# EAGLE design Interface_ETH (EAGLE 9.6.2)

## Sheet 1 of 3: Ethernet
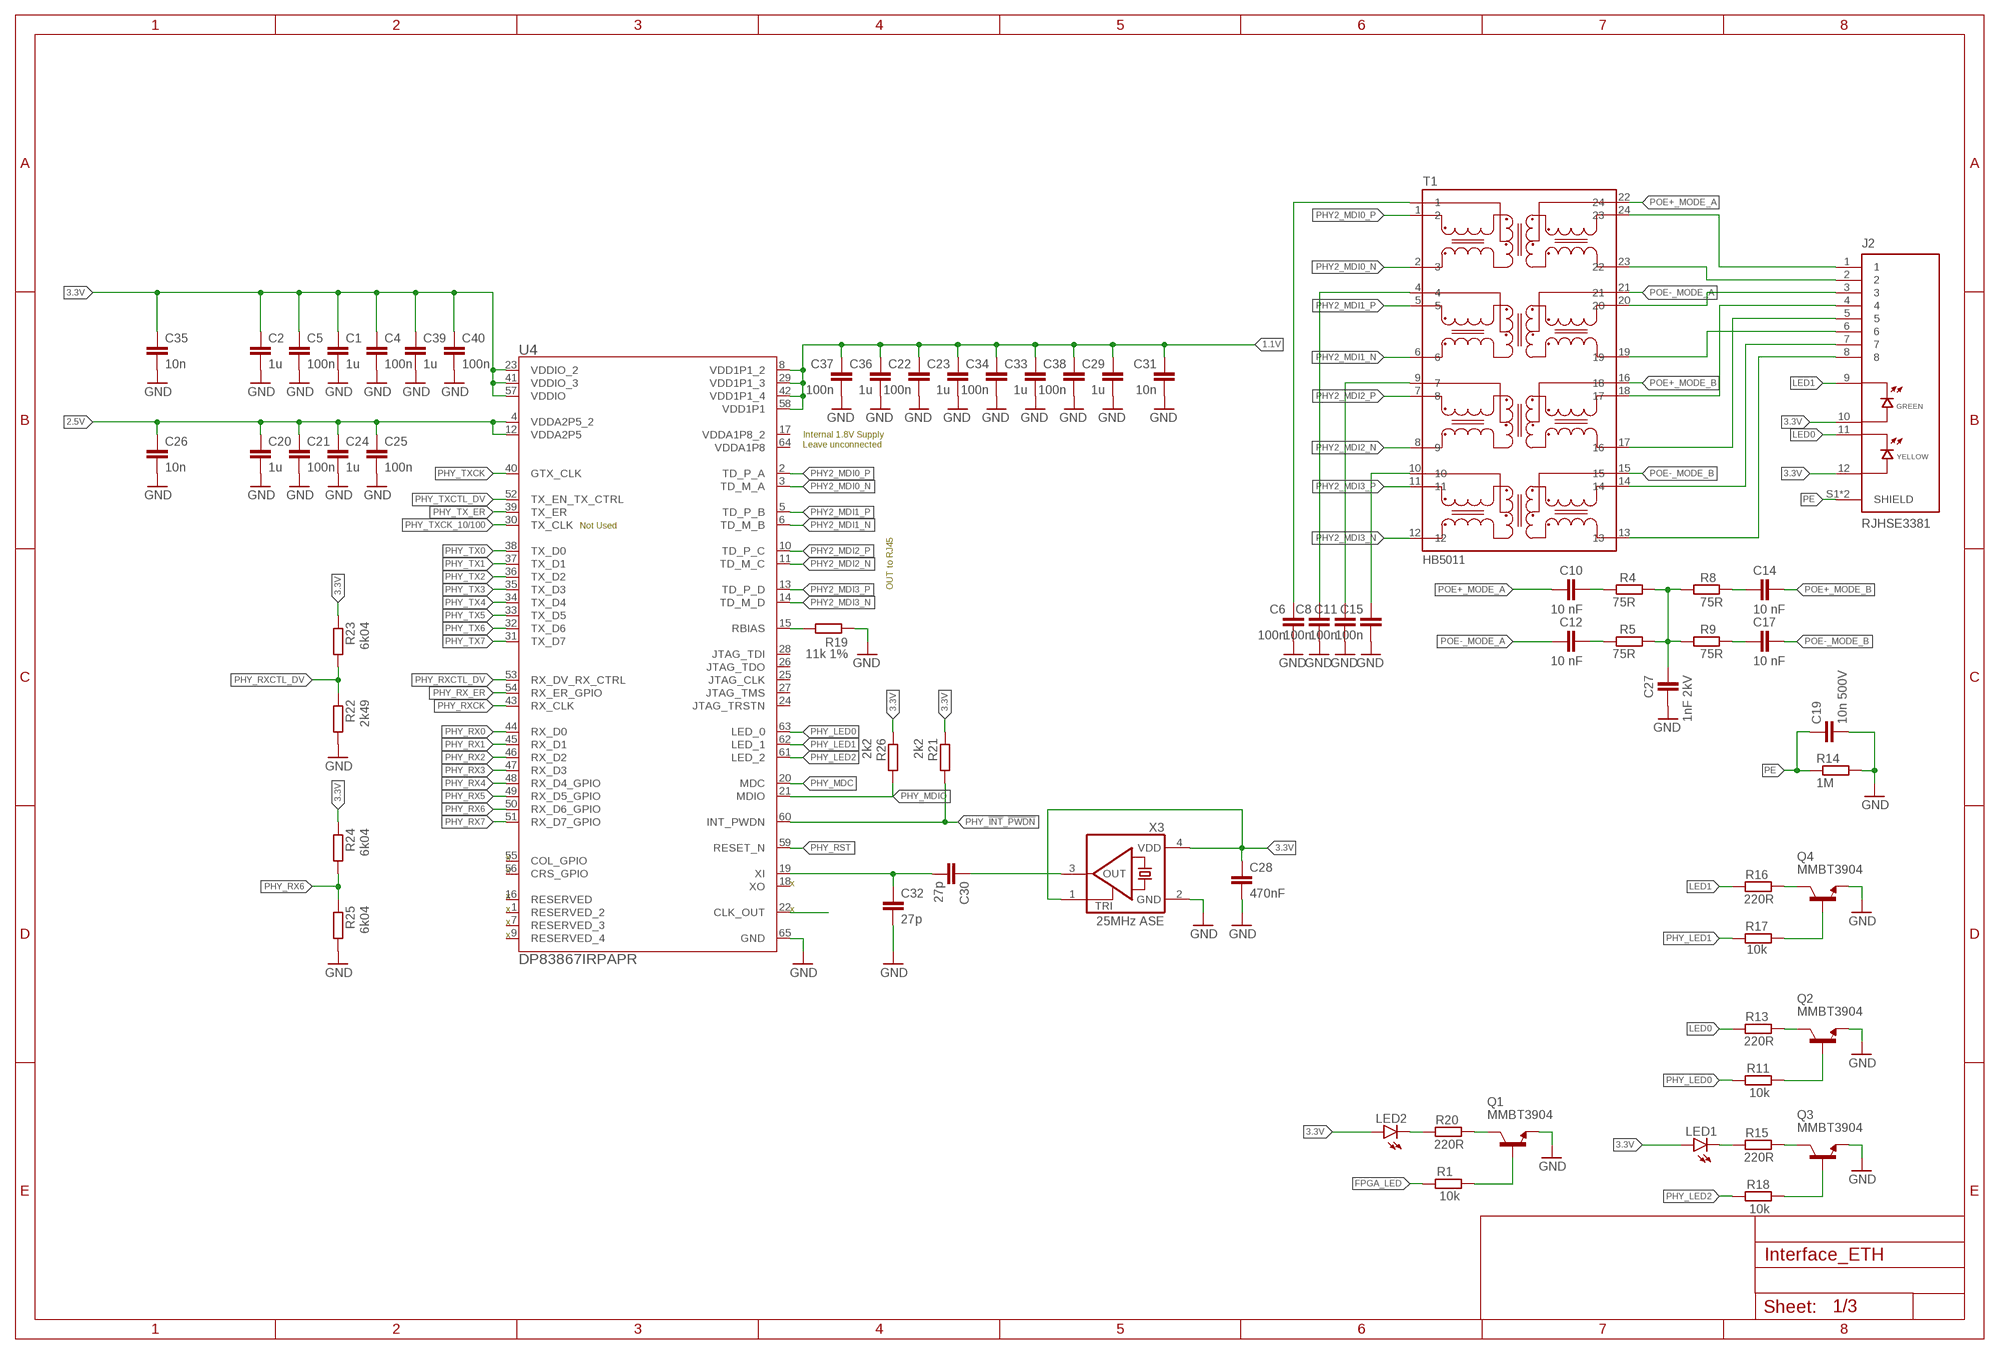
[diagram p0: schematic, sheet 1]

### Parts
C1  1u  C-EUC0402  [C0402]
C2  1u  C-EUC0402  [C0402]
C4  100n  C-EUC0402  [C0402]
C5  100n  C-EUC0402  [C0402]
C6  100n  C-EUC0402  [C0402]
C8  100n  C-EUC0402  [C0402]
C10  10 nF  C-EUC0603  [C0603]
C11  100n  C-EUC0402  [C0402]
C12  10 nF  C-EUC0603  [C0603]
C14  10 nF  C-EUC0603  [C0603]
C15  100n  C-EUC0402  [C0402]
C17  10 nF  C-EUC0603  [C0603]
C19  10n 500V  C-EUC0805  [C0805]
C20  1u  C-EUC0402  [C0402]
C21  100n  C-EUC0402  [C0402]
C22  100n  C-EUC0402  [C0402]
C23  1u  C-EUC0402  [C0402]
C24  1u  C-EUC0402  [C0402]
C25  100n  C-EUC0402  [C0402]
C26  10n  C-EUC0402  [C0402]
C27  1nF 2kV  C-EUC1206  [C1206]
C28  470nF  C-EUC0402  [C0402]
C29  1u  C-EUC0402  [C0402]
C30  27p  C-EUC0402  [C0402]
C31  10n  C-EUC0402  [C0402]
C32  27p  C-EUC0402  [C0402]
C33  1u  C-EUC0402  [C0402]
C34  100n  C-EUC0402  [C0402]
C35  10n  C-EUC0402  [C0402]
C36  1u  C-EUC0402  [C0402]
C37  100n  C-EUC0402  [C0402]
C38  100n  C-EUC0402  [C0402]
C39  1u  C-EUC0402  [C0402]
C40  100n  C-EUC0402  [C0402]
J2  RJHSE3381  [AMPHENOL_RJHSE3381]
LED1  LEDCHIP-LED0805  [CHIP-LED0805]
LED2  LEDCHIP-LED0603  [CHIP-LED0603]
Q1  MMBT3904  2N3904-MMBT  [SOT23]
Q2  MMBT3904  2N3904-MMBT  [SOT23]
Q3  MMBT3904  2N3904-MMBT  [SOT23]
Q4  MMBT3904  2N3904-MMBT  [SOT23]
R1  10k  R-EU_R0603  [R0603]
R4  75R  R-EU_R0603  [R0603]
R5  75R  R-EU_R0603  [R0603]
R8  75R  R-EU_R0603  [R0603]
R9  75R  R-EU_R0603  [R0603]
R11  10k  R-EU_R0603  [R0603]
R13  220R  R-EU_R0603  [R0603]
R14  1M  R-EU_R0603  [R0603]
R15  220R  R-EU_R0603  [R0603]
R16  220R  R-EU_R0603  [R0603]
R17  10k  R-EU_R0603  [R0603]
R18  10k  R-EU_R0603  [R0603]
R19  11k 1%  R-EU_R0402  [R0402]
R20  220R  R-EU_R0603  [R0603]
R21  2k2  R-EU_R0402  [R0402]
R22  2k49  R-EU_R0402  [R0402]
R23  6k04  R-EU_R0402  [R0402]
R24  6k04  R-EU_R0402  [R0402]
R25  6k04  R-EU_R0402  [R0402]
R26  2k2  R-EU_R0402  [R0402]
T1  HB5011  [HB5011]
U4  DP83867IRPAPR  [PAP0064M_N]
X3  25MHz ASE  ASE  [ASE]

### Nets
1.1V: C22.1 C23.1 C29.1 C31.1 C33.1 C34.1 C36.1 C37.1 C38.1 U4.8(VDD1P1_2) U4.29(VDD1P1_3) U4.42(VDD1P1_4) U4.58(VDD1P1) ; also sheet 2
2.5V: C20.1 C21.1 C24.1 C25.1 C26.1 U4.4(VDDA2P5_2) U4.12(VDDA2P5) ; also sheet 2
3.3V: C1.1 C2.1 C4.1 C5.1 C28.1 C35.1 C39.1 C40.1 J2.10 J2.12 LED1.A LED2.A R21.1 R23.1 R24.1 R26.1 U4.23(VDDIO_2) U4.41(VDDIO_3) U4.57(VDDIO) X3.1(TRI) X3.4(VDD) ; also sheet 2
ETH_1: J2.1 T1.24
ETH_2: J2.2 T1.23
ETH_3: J2.3 T1.20
ETH_4: J2.4 T1.18
ETH_5: J2.5 T1.17
ETH_6: J2.6 T1.19
ETH_7: J2.7 T1.14
ETH_8: J2.8 T1.13
FPGA_LED: R1.1 ; also sheet 2
GND: C1.2 C2.2 C4.2 C5.2 C6.2 C8.2 C11.2 C15.2 C19.2 C20.2 C21.2 C22.2 C23.2 C24.2 C25.2 C26.2 C27.2 C28.2 C29.2 C31.2 C32.2 C33.2 C34.2 C35.2 C36.2 C37.2 C38.2 C39.2 C40.2 Q1.2(E) Q2.2(E) Q3.2(E) Q4.2(E) R14.2 R19.1 R22.2 R25.2 U4.65(GND) X3.2(GND) ; also sheet 2
LED0: J2.11 R13.1
LED1: J2.9 R16.1
N$00013: C30.1 X3.3(OUT)
N$00014: Q3.3(C) R15.2
N$00015: Q3.1(B) R18.2
N$00022: C15.1 T1.10
N$00023: C11.1 T1.9
N$00024: C8.1 T1.4
N$00025: C6.1 T1.3
N$00026: C30.2 C32.1 U4.19(XI)
N$00031: Q1.3(C) R20.2
N$00032: LED1.C R15.1
N$00033: U4.22(CLK_OUT)
N$00034: Q1.1(B) R1.2
N$00035: LED2.C R20.1
N$00049: C14.1 R8.2
N$00050: C17.1 R9.2
N$00051: C10.1 R4.2
N$00052: C12.1 R5.2
N$00053: C27.1 R4.1 R5.1 R8.1 R9.1
N$00084: R19.2 U4.15(RBIAS)
N$00105: Q4.3(C) R16.2
N$00107: Q2.3(C) R13.2
N$00108: Q4.1(B) R17.2
N$00109: Q2.1(B) R11.2
PE: C19.1 J2.S1(SHIELD) J2.S2(SHIELD) R14.1 ; also sheet 2
PHY2_MDI0_N [diff]: T1.2 U4.3(TD_M_A)
PHY2_MDI0_P [diff]: T1.1 U4.2(TD_P_A)
PHY2_MDI1_N [diff]: T1.6 U4.6(TD_M_B)
PHY2_MDI1_P [diff]: T1.5 U4.5(TD_P_B)
PHY2_MDI2_N [diff]: T1.8 U4.11(TD_M_C)
PHY2_MDI2_P [diff]: T1.7 U4.10(TD_P_C)
PHY2_MDI3_N [diff]: T1.12 U4.14(TD_M_D)
PHY2_MDI3_P [diff]: T1.11 U4.13(TD_P_D)
PHY_!INT!_!PWDN: R21.2 U4.60(INT_PWDN) ; also sheet 2
PHY_LED0: R11.1 U4.63(LED_0)
PHY_LED1: R17.1 U4.62(LED_1)
PHY_LED2: R18.1 U4.61(LED_2)
PHY_MDC: U4.20(MDC) ; also sheet 2
PHY_MDIO: R26.2 U4.21(MDIO) ; also sheet 2
PHY_RST: U4.59(RESET_N) ; also sheet 2
PHY_RX0: U4.44(RX_D0) ; also sheet 2
PHY_RX1: U4.45(RX_D1) ; also sheet 2
PHY_RX2: U4.46(RX_D2) ; also sheet 2
PHY_RX3: U4.47(RX_D3) ; also sheet 2
PHY_RX4: U4.48(RX_D4_GPIO) ; also sheet 2
PHY_RX5: U4.49(RX_D5_GPIO) ; also sheet 2
PHY_RX6: R24.2 R25.1 U4.50(RX_D6_GPIO) ; also sheet 2
PHY_RX7: U4.51(RX_D7_GPIO) ; also sheet 2
PHY_RX_ER: U4.54(RX_ER_GPIO) ; also sheet 2
PHY_RXCK: U4.43(RX_CLK) ; also sheet 2
PHY_RXCTL_DV: R22.1 R23.2 U4.53(RX_DV_RX_CTRL) ; also sheet 2
PHY_TX0: U4.38(TX_D0) ; also sheet 2
PHY_TX1: U4.37(TX_D1) ; also sheet 2
PHY_TX2: U4.36(TX_D2) ; also sheet 2
PHY_TX3: U4.35(TX_D3) ; also sheet 2
PHY_TX4: U4.34(TX_D4) ; also sheet 2
PHY_TX5: U4.33(TX_D5) ; also sheet 2
PHY_TX6: U4.32(TX_D6) ; also sheet 2
PHY_TX7: U4.31(TX_D7) ; also sheet 2
PHY_TX_ER: U4.39(TX_ER) ; also sheet 2
PHY_TXCK: U4.40(GTX_CLK) ; also sheet 2
PHY_TXCK_10/100: U4.30(TX_CLK) ; also sheet 2
PHY_TXCTL_DV: U4.52(TX_EN_TX_CTRL) ; also sheet 2
POE+_MODE_A: C10.2 T1.22 ; also sheet 2
POE+_MODE_B: C14.2 T1.16 ; also sheet 2
POE-_MODE_A: C12.2 T1.21 ; also sheet 2
POE-_MODE_B: C17.2 T1.15 ; also sheet 2
Unconnected: U4.1(RESERVED_2) U4.7(RESERVED_3) U4.9(RESERVED_4) U4.16(RESERVED) U4.18(XO) U4.24(JTAG_TRSTN) U4.25(JTAG_CLK) U4.26(JTAG_TDO) U4.27(JTAG_TMS) U4.28(JTAG_TDI) U4.55(COL_GPIO) U4.56(CRS_GPIO)

### Notes on the sheet
- Internal 1.8V Supply
  Leave unconnected
- Not Used
- OUT to RJ45
- x
- x
- x
- x
- x | x
- x
- x

## Sheet 2 of 3: Power
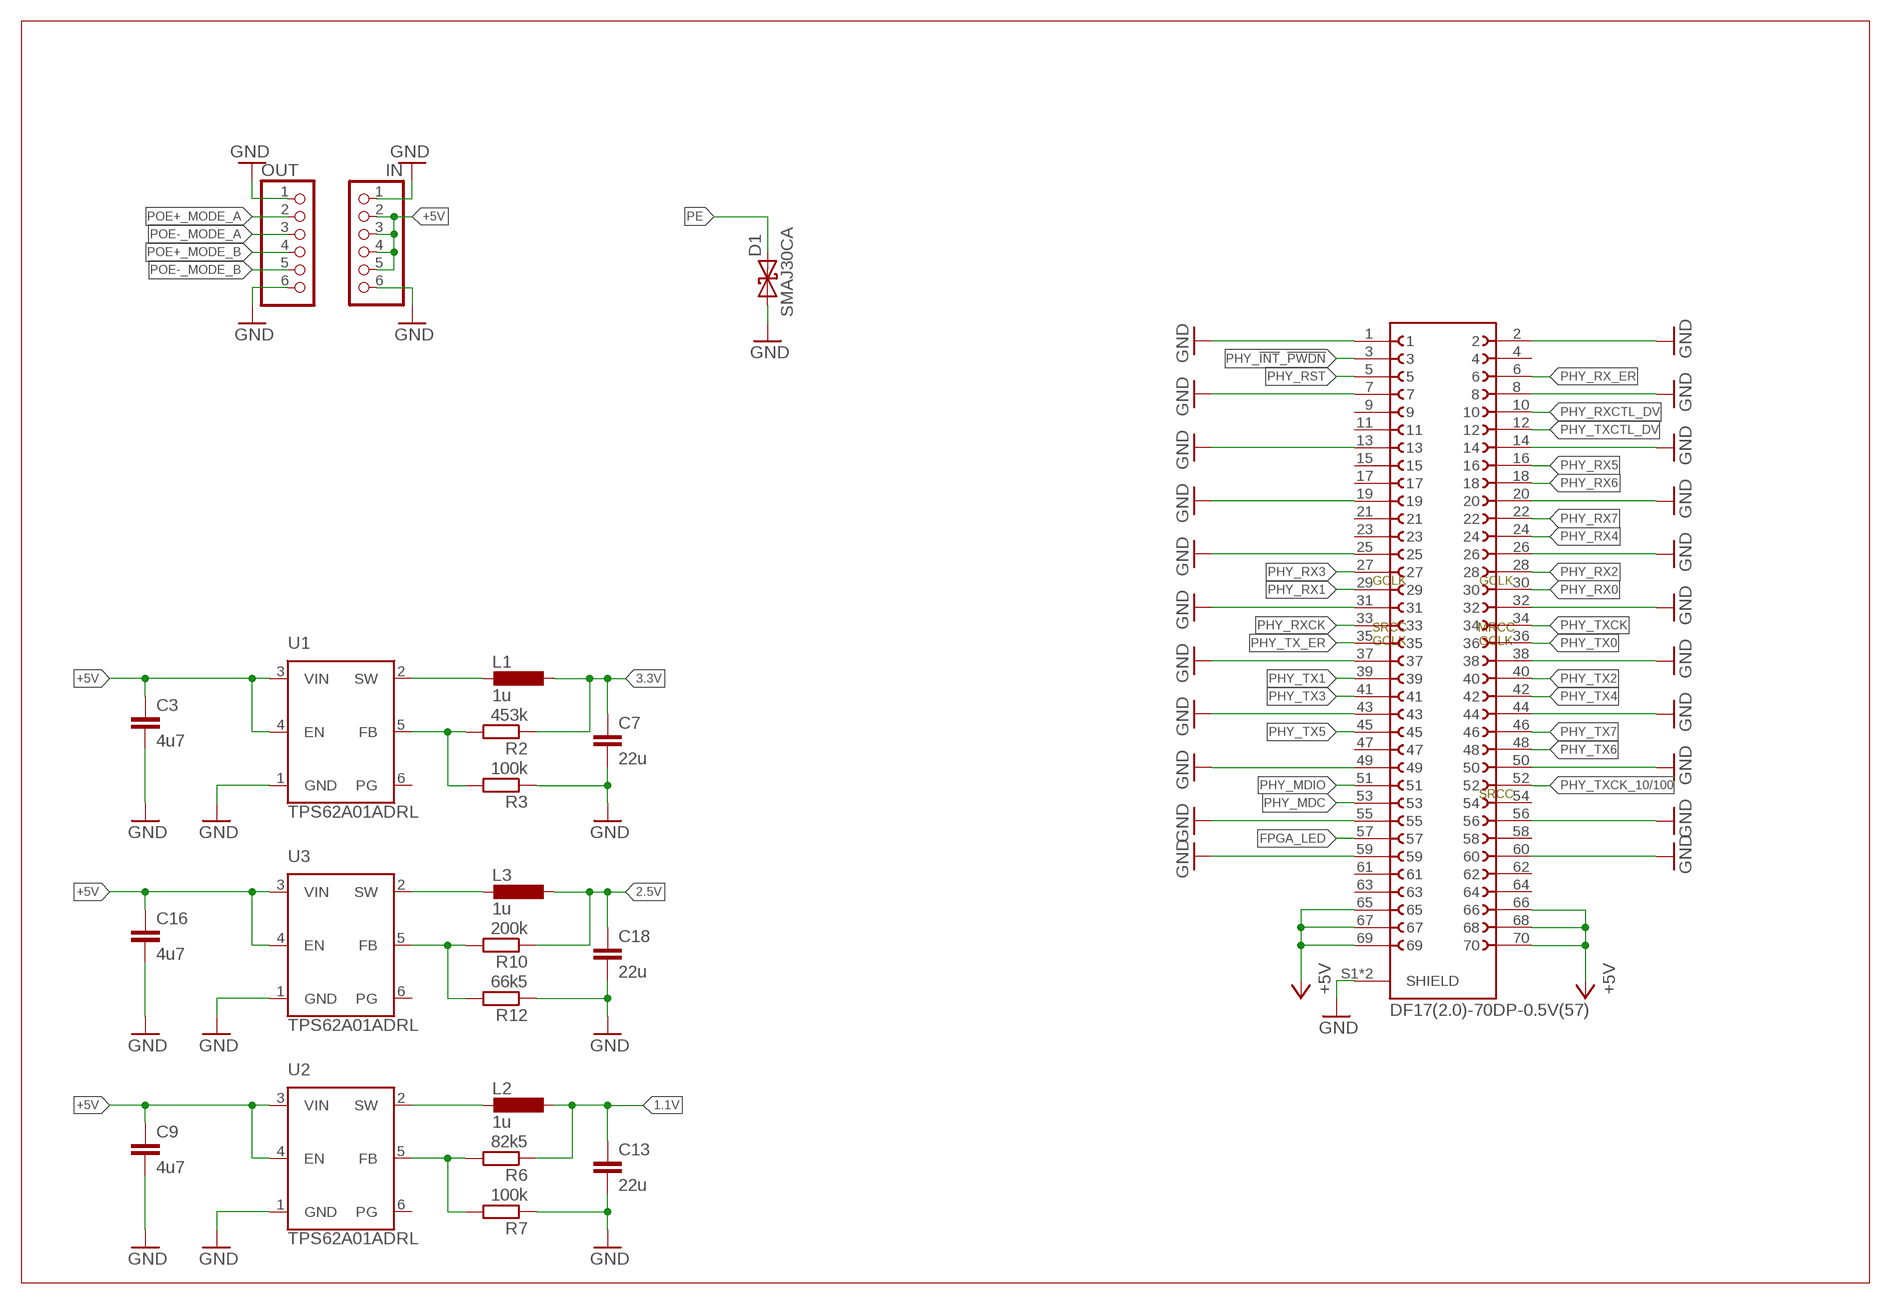
[diagram p1: schematic, sheet 2]

### Parts
C3  4u7  C-EUC0603  [C0603]
C7  22u  C-EUC0603  [C0603]
C9  4u7  C-EUC0603  [C0603]
C13  22u  C-EUC0603  [C0603]
C16  4u7  C-EUC0603  [C0603]
C18  22u  C-EUC0603  [C0603]
D1  SMAJ30CA  SMAJ_DIODE  [DO214AC]
IN  PINHD-1X06_2.00  [1X06M]
J1  DF17(2.0)-70DP-0.5V(57)  [DF17(2.0)-70DP-0.5V(57)]
L1  1u  L-EU1008  [L1008]
L2  1u  L-EU1008  [L1008]
L3  1u  L-EU1008  [L1008]
OUT  PINHD-1X06_2.00  [1X06M]
R2  453k  R-EU_R0402  [R0402]
R3  100k  R-EU_R0402  [R0402]
R6  82k5  R-EU_R0402  [R0402]
R7  100k  R-EU_R0402  [R0402]
R10  200k  R-EU_R0402  [R0402]
R12  66k5  R-EU_R0402  [R0402]
U1  TPS62A01ADRL  [SOTFL50P160X60-6N]
U2  TPS62A01ADRL  [SOTFL50P160X60-6N]
U3  TPS62A01ADRL  [SOTFL50P160X60-6N]

### Nets
1.1V: C13.1 L2.1 R6.1 ; also sheet 1
2.5V: C18.1 L3.1 R10.1 ; also sheet 1
3.3V: C7.1 L1.1 R2.1 ; also sheet 1
+5V: C3.1 C9.1 C16.1 IN.2 IN.3 IN.4 IN.5 J1.65 J1.66 J1.67 J1.68 J1.69 J1.70 U1.3(VIN) U1.4(EN) U2.3(VIN) U2.4(EN) U3.3(VIN) U3.4(EN)
FPGA_LED: J1.57 ; also sheet 1
GND: C3.2 C7.2 C9.2 C13.2 C16.2 C18.2 D1.A IN.1 IN.6 J1.1 J1.2 J1.7 J1.8 J1.13 J1.14 J1.19 J1.20 J1.25 J1.26 J1.31 J1.32 J1.37 J1.38 J1.43 J1.44 J1.49 J1.50 J1.55 J1.56 J1.59 J1.60 J1.S1(SHIELD) J1.S2(SHIELD) OUT.1 OUT.6 R3.1 R7.1 R12.1 U1.1(GND) U2.1(GND) U3.1(GND) ; also sheet 1
N$00027: L2.2 U2.2(SW)
N$00028: L1.2 U1.2(SW)
N$00029: L3.2 U3.2(SW)
N$00030: R10.2 R12.2 U3.5(FB)
N$00040: R6.2 R7.2 U2.5(FB)
N$00044: R2.2 R3.2 U1.5(FB)
PE: D1.C ; also sheet 1
PHY_!INT!_!PWDN: J1.3 ; also sheet 1
PHY_MDC: J1.53 ; also sheet 1
PHY_MDIO: J1.51 ; also sheet 1
PHY_RST: J1.5 ; also sheet 1
PHY_RX0: J1.30 ; also sheet 1
PHY_RX1: J1.29 ; also sheet 1
PHY_RX2: J1.28 ; also sheet 1
PHY_RX3: J1.27 ; also sheet 1
PHY_RX4: J1.24 ; also sheet 1
PHY_RX5: J1.16 ; also sheet 1
PHY_RX6: J1.18 ; also sheet 1
PHY_RX7: J1.22 ; also sheet 1
PHY_RX_ER: J1.6 ; also sheet 1
PHY_RXCK: J1.33 ; also sheet 1
PHY_RXCTL_DV: J1.10 ; also sheet 1
PHY_TX0: J1.36 ; also sheet 1
PHY_TX1: J1.39 ; also sheet 1
PHY_TX2: J1.40 ; also sheet 1
PHY_TX3: J1.41 ; also sheet 1
PHY_TX4: J1.42 ; also sheet 1
PHY_TX5: J1.45 ; also sheet 1
PHY_TX6: J1.48 ; also sheet 1
PHY_TX7: J1.46 ; also sheet 1
PHY_TX_ER: J1.35 ; also sheet 1
PHY_TXCK: J1.34 ; also sheet 1
PHY_TXCK_10/100: J1.52 ; also sheet 1
PHY_TXCTL_DV: J1.12 ; also sheet 1
POE+_MODE_A: OUT.2 ; also sheet 1
POE+_MODE_B: OUT.4 ; also sheet 1
POE-_MODE_A: OUT.3 ; also sheet 1
POE-_MODE_B: OUT.5 ; also sheet 1
Unconnected: J1.4 J1.9 J1.11 J1.15 J1.17 J1.21 J1.23 J1.47 J1.54 J1.58 J1.61 J1.62 J1.63 J1.64 U1.6(PG) U2.6(PG) U3.6(PG)

### Notes on the sheet
- GCLK | GCLK
- SRCC
  GCLK
- MRCC
  GCLK
- SRCC

## Sheet 3 of 3

## Power pins joined to a net without a drawn wire
VDDA1P8: U4.64(VDDA1P8)
VDDA1P8_2: U4.17(VDDA1P8_2)

## Library data of the parts
C1 C2 C4-C6 C8 C11 C15 C20-C26 C28-C40 = rcl:C-EU: CAPACITOR, European symbol; FARNELL: 2409032; PARAMETER: 6.3V 10% X5R; PREIS: 0,0916
C3 C9 C16 = rcl:C-EU: CAPACITOR, European symbol; LCSC: C19666
C7 C13 C18 = rcl:C-EU: CAPACITOR, European symbol; LCSC: C109448
C10 C12 C14 C17 = rcl:C-EU: CAPACITOR, European symbol; FARNELL: 1288254; LCSC: C599809; SPICEPREFIX: C
C19 = rcl:C-EU: CAPACITOR, European symbol; BUERKLIN: 56D510; PARAMETER: 500V, 10%, X7R
C27 = rcl:C-EU: CAPACITOR, European symbol; FARNELL: 1650716; LCSC: C9196; SPICEPREFIX: C
D1 = mh_fpga_anschlussplatine_v2:SMAJ_DIODE; FARNELL: 1827672; LCSC: C83322; MBM: 5; PARAMETER: 30V VRM, 33.3V VBR_MIN, 36.8V VBR_MAX; PREIS: 0,343
IN OUT = pinhead-2:PINHD-1X06: PIN HEADER
J1 = Hirose:DF17(2.0)-70DP-0.5V(57)
J2 = RJHSE3381:RJHSE3381; DIGIKEY: 664-RJHSE3381-ND; MANUFACTURER: Amphenol Connex; MAXIMUM_PACKAGE_HEIGHT: 16.38 mm; PARTREV: R; SNAPEDA_PN: RJHSE3381; STANDARD: Manufacturer Recommendations
L1-L3 = rcl:L-EU: INDUCTOR, European symbol; DIGIKEY: 490-5112-1-ND; LCSC: C86091; MPN: LQM2HPN1R0MG0L
LED1 LED2 = led:LED: LED OSRAM: - CHIPLED LG R971, LG N971, LY N971, LG Q971, LY Q971, LO R971, LY R971 LH N974, LH R974 LS Q976, LO Q976, LY Q976 LO Q996 - Hyper CHIPLED LW Q18S LB Q993, LB Q99A, LB R99A - SideLED LS A670, LO A670, LY A670, LG A670, LP A670 LB A673, LV A673, LT A673, LW A673 LH A674 LY A675 LS A676, LA A676, LO A676, LY A676, LW A676 LS A679, LY A679, LG A679 - Hyper Micro SIDELED® LS Y876, LA Y876, LO Y876, LY Y876 LT Y87S - SmartLED LW L88C, LW L88S LB L89C, LB L89S, LG L890 LS L89K, LO L89K, LY L89K LS L896, LA L896, LO L896, LY L896 - TOPLED LS T670, LO T670, LY T670, LG T670, LP T670 LSG T670, LSP T670, LSY T670, LOP T670, LYG T670 LG T671, LOG T671, LSG T671 LB T673, LV T673, LT T673, LW T673 LH T674 LS T676, LA T676, LO T676, LY T676, LB T676, LH T676, LSB T676, LW T676 LB T67C, LV T67C, LT T67C, LS T67K, LO T67K, LY T67K, LW E67C LS E67B, LA E67B, LO E67B, LY E67B, LB E67C, LV E67C, LT E67C LW T67C LS T679, LY T679, LG T679 LS T770, LO T770, LY T770, LG T770, LP T770 LB T773, LV T773, LT T773, LW T773 LH T774 LS E675, LA E675, LY E675, LS T675 LS T776, LA T776, LO T776, LY T776, LB T776 LHGB T686 LT T68C, LB T68C - Hyper Mini TOPLED® LB M676 - Mini TOPLED Santana® LG M470 LS M47K, LO M47K, LY M47K Source: http://www.osram.convergy.de LUXEON: - LUMILED® LXK2-PW12-R00, LXK2-PW12-S00, LXK2-PW14-U00, LXK2-PW14-V00 LXK2-PM12-R00, LXK2-PM12-S00, LXK2-PM14-U00 LXK2-PE12-Q00, LXK2-PE12-R00, LXK2-PE12-S00, LXK2-PE14-T00, LXK2-PE14-U00 LXK2-PB12-K00, LXK2-PB12-L00, LXK2-PB12-M00, LXK2-PB14-N00, LXK2-PB14-P00, LXK2-PB14-Q00 LXK2-PR12-L00, LXK2-PR12-M00, LXK2-PR14-Q00, LXK2-PR14-R00 LXK2-PD12-Q00, LXK2-PD12-R00, LXK2-PD12-S00 LXK2-PH12-R00, LXK2-PH12-S00 LXK2-PL12-P00, LXK2-PL12-Q00, LXK2-PL12-R00 Source: www.luxeon.com KINGBRIGHT: KA-3528ASYC Source: www.kingbright.com
Q1-Q4 = m-pad-2.1:2N3904: NPN TRANSISTOR; FARNELL: 1757935
R1 R11 R17 R18 = rcl:R-EU_: RESISTOR, European symbol; BUERKLIN: 26E816; LAGERORT: 45/08; MBM: 10; PARAMETER: 0.1W, 1%; PREIS: 0,0357
R2 R10 = rcl:R-EU_: RESISTOR, European symbol; LCSC: C137978; SPICEPREFIX: R
R3 R12 = rcl:R-EU_: RESISTOR, European symbol; DIGIKEY: RMCF0402FT100KCT-ND; LCSC: C60491; SPICEPREFIX: R
R4 R5 R8 R9 = rcl:R-EU_: RESISTOR, European symbol; FARNELL: 1527343; LCSC: C4275
R6 = rcl:R-EU_: RESISTOR, European symbol; DIGIKEY: RMCF0402FT66K5CT-ND; LCSC: C2998095; SPICEPREFIX: R
R7 = rcl:R-EU_: RESISTOR, European symbol; LCSC: C60491; SPICEPREFIX: R
R13 R15 R16 R20 = rcl:R-EU_: RESISTOR, European symbol; BUERKLIN: 07E532; LAGERORT: 90/08; MBM: 10; PARAMETER: 0.1W, 1%; PREIS: 0,0357
R14 = rcl:R-EU_: RESISTOR, European symbol; BUERKLIN: 26E864; LAGERORT: 85/09; MBM: 10; PARAMETER: 0.1W, 1%; PREIS: 0,0357
R19 R21-R26 = rcl:R-EU_: RESISTOR, European symbol; FARNELL: 1652885; PARAMETER: 1%, 100ppm, 75V
T1 = misc:HB5011; DIGIKEY: 931-TM82467NLCT-ND
U1-U3 = TPS62A01DRLR:TPS62A01ADRL; DESCRIPTION: 2.5V-5.5V input, 1-A high efficiency step-down converter in 2x2 QFN or SOT563 package; DIGIKEY: 296-TPS62A01ADRLRCT-ND; HEIGHT: 0.6mm; LCSC: C5181455; MANUFACTURER_NAME: Texas Instruments; MANUFACTURER_PART_NUMBER: TPS62A01ADRLR; MOUSER: 595-TPS62A01ADRLR
U4 = texas:DP83867IRPAPR: DP83867IRPAP 10/100/1000 Base-TX PHY; MFR_NAME: Texas Instruments; MPN: DP83867IRPAPR
X3 = crystal:ASE: 3.3Vdc CMOS SMD CRYSTAL CLOCK OSCILLATOR SOurce: www.abracon.com; DIGIKEY: 535-9577-1-ND; OC_FARNELL: unknown; OC_NEWARK: unknown

## Net classes
0 default: width 0.15 mm, drill 0.3 mm
1 diff_pair: width 0.15 mm, drill 0.3 mm
2 diff: width 0.125 mm, drill 0.2 mm, clearance 0.125 mm

## Board
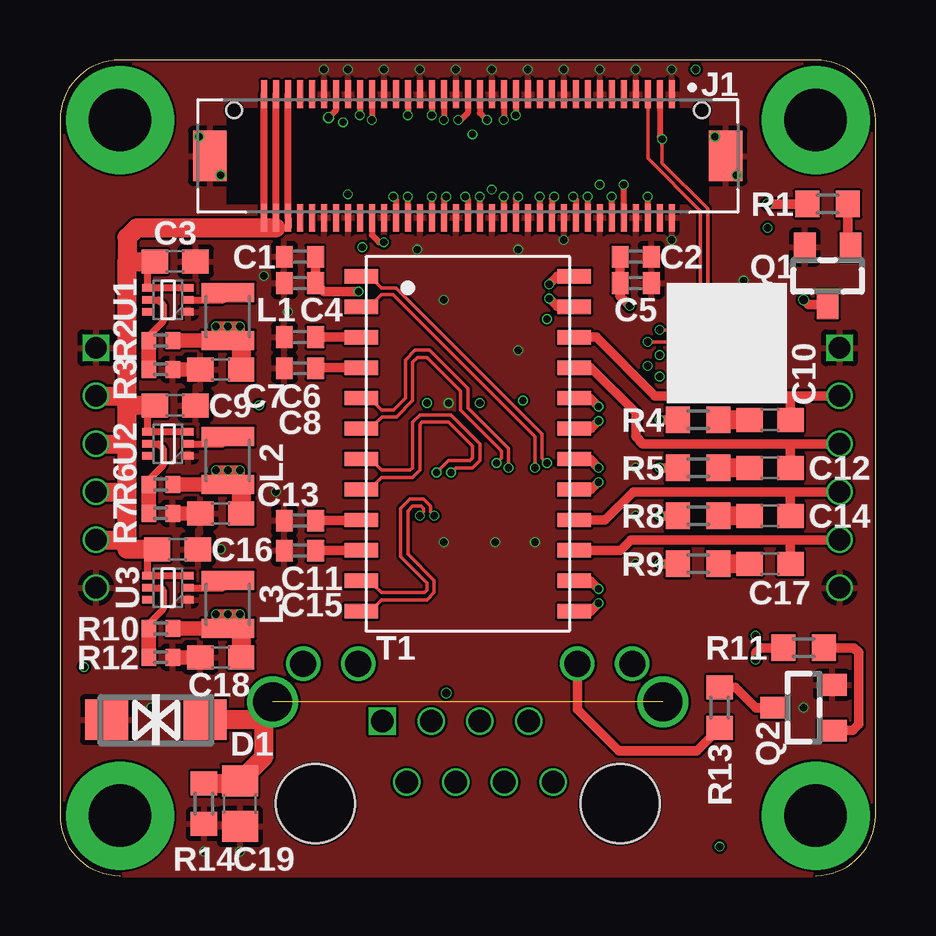
[diagram p2: board, top side]
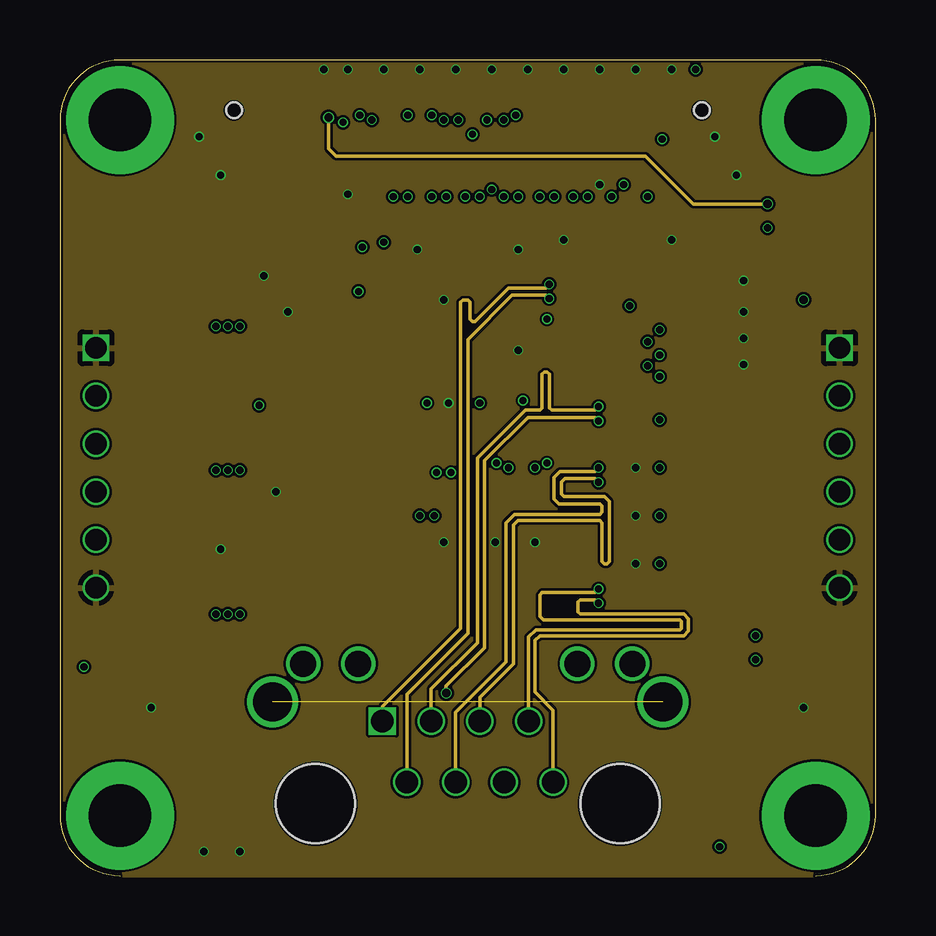
[diagram p3: board, inner layer Route2]
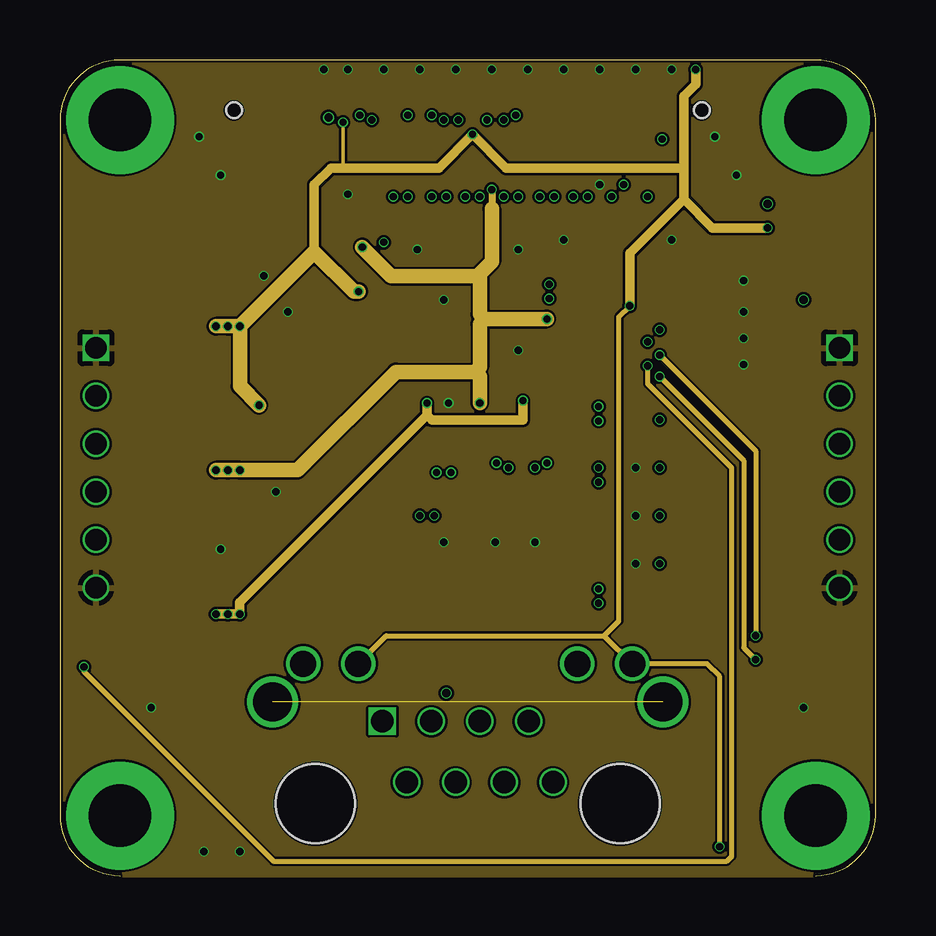
[diagram p4: board, inner layer Route15]
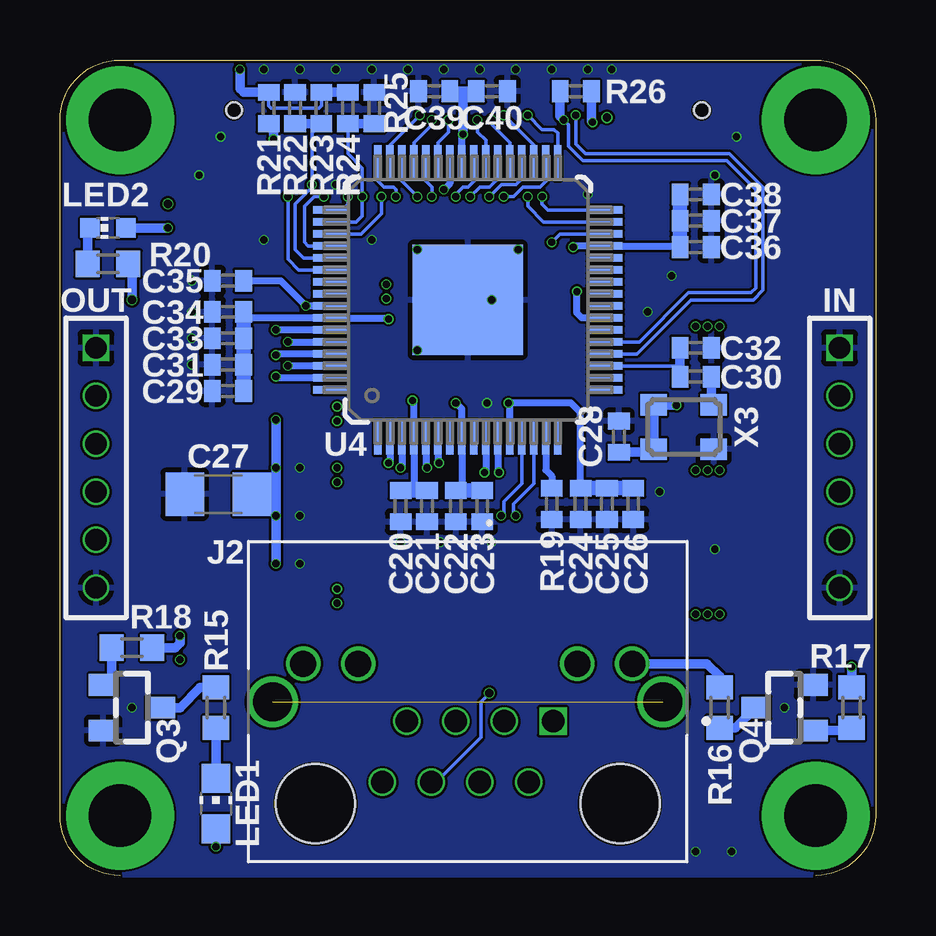
[diagram p5: board, bottom side, seen from below]

Size 34 x 34 mm. Coordinates in mm from the lower left corner, seen from the top.
Outline: 2.5,0 arc-90 0,2.5 0,31.5 arc-90 2.5,34 31.5,34 arc-90 34,31.5 34,2.5 arc-90 31.5,0
Copper layers (1+2*15+16): Top 0.035559375mm / dielectric 0.17018125mm / Route2 0.01778125mm / dielectric 47mil / Route15 0.01778125mm / dielectric 0.17018125mm / Bottom 0.035559375mm
Design rules "jlcpcb-6-layer *": minimum track width 0.1mm, minimum drill 0.3mm, track to track 0.1mm, track to pad 5mil, pad to pad 5mil, via to via 5mil, smd to smd 0mil, copper to edge 0.1mm, drill to drill 5mil, minimum pad ring 4mil, minimum via ring 0.05mm, stop-mask expansion 3mil, vias tented up to drill 100mil, thermal gap 8mil

### Footprints (pad centres in the part's own frame; a part is rotated, then mirrored left to right if it is on the bottom)
C0402 = smd 0.7 x 0.9: 1 -0.65,0; 2 0.65,0
C0603 = smd 1.1 x 1: 1 -0.85,0; 2 0.85,0
C0805 = smd 1.3 x 1.5: 1 -0.95,0; 2 0.95,0
C1206 = smd 1.6 x 1.8: 1 -1.4,0; 2 1.4,0
DO214AC = smd 1.8 x 1.7: A 2.05,0; C -2.05,0
1X06M = drill 0.914 square: 1 -5,0 | drill 0.914: 2 -3,0; 3 -1,0; 4 1,0; 5 3,0; 6 5,0
DF17(2.0)-70DP-0.5V(57) = smd 0.25 x 1.15: 1 -8.5,-2.575; 2 -8.5,2.575; 3 -8,-2.575; 4 -8,2.575; 5 -7.5,-2.575; 6 -7.5,2.575; 7 -7,-2.575; 8 -7,2.575; 9 -6.5,-2.575; 10 -6.5,2.575; 11 -6,-2.575; 12 -6,2.575; 13 -5.5,-2.575; 14 -5.5,2.575; 15 -5,-2.575; 16 -5,2.575; 17 -4.5,-2.575; 18 -4.5,2.575; 19 -4,-2.575; 20 -4,2.575; 21 -3.5,-2.575; 22 -3.5,2.575; 23 -3,-2.575; 24 -3,2.575; 25 -2.5,-2.575; 26 -2.5,2.575; 27 -2,-2.575; 28 -2,2.575; 29 -1.5,-2.575; 30 -1.5,2.575; 31 -1,-2.575; 32 -1,2.575; 33 -0.5,-2.575; 34 -0.5,2.575; 35 0,-2.575; 36 0,2.575; 37 0.5,-2.575; 38 0.5,2.575; 39 1,-2.575; 40 1,2.575; 41 1.5,-2.575; 42 1.5,2.575; 43 2,-2.575; 44 2,2.575; 45 2.5,-2.575; 46 2.5,2.575; 47 3,-2.575; 48 3,2.575; 49 3.5,-2.575; 50 3.5,2.575; 51 4,-2.575; 52 4,2.575; 53 4.5,-2.575; 54 4.5,2.575; 55 5,-2.575; 56 5,2.575; 57 5.5,-2.575; 58 5.5,2.575; 59 6,-2.575; 60 6,2.575; 61 6.5,-2.575; 62 6.5,2.575; 63 7,-2.575; 64 7,2.575; 65 7.5,-2.575; 66 7.5,2.575; 67 8,-2.575; 68 8,2.575; 69 8.5,-2.575; 70 8.5,2.575 | smd 1.4 x 2.1: S1 -10.75,0; S2 10.75,0 | hole 0.65: -9.75,-1.9; 9.75,-1.9
AMPHENOL_RJHSE3381 = drill 0.94 square: 1 3.556,3.43 | drill 0.94: 2 2.54,0.89; 3 1.524,3.43; 4 0.508,0.89; 5 -0.508,3.43; 6 -1.524,0.89; 7 -2.54,3.43; 8 -3.556,0.89 | drill 1.09 pad 1.44: 9 6.86,5.827; 10 4.57,5.827; 11 -4.57,5.827; 12 -6.86,5.827 | drill 1.62 pad 2.128: S1 -8.13,4.24; S2 8.13,4.24 | hole 3.3: -6.35,0; 6.35,0
L1008 = smd 0.8 x 2.2: 1 -1,0; 2 1,0
CHIP-LED0805 = smd 1.2 x 1.2: A 0,-1.05; C 0,1.05
CHIP-LED0603 = smd 0.8 x 0.8: A 0,-0.75; C 0,0.75
SOT23 = smd 0.9 x 1.2: 1 -0.95,-1.2; 2 0.95,-1.2; 3 0,1.2
R0603 = smd 1 x 1.1: 1 -0.85,0; 2 0.85,0
R0402 = smd 0.6 x 0.7: 1 -0.5,0; 2 0.5,0
R0402' = smd 0.7 x 0.9: 1 -0.65,0; 2 0.65,0
HB5011 = smd 0.6 x 1.4: 1 -6.985,-4.445; 2 -5.715,-4.445; 3 -4.445,-4.445; 4 -3.175,-4.445; 5 -1.905,-4.445; 6 -0.635,-4.445; 7 0.635,-4.445; 8 1.905,-4.445; 9 3.175,-4.445; 10 4.445,-4.445; 11 5.715,-4.445; 12 6.985,-4.445; 13 6.985,4.445; 14 5.715,4.445; 15 4.445,4.445; 16 3.175,4.445; 17 1.905,4.445; 18 0.635,4.445; 19 -0.635,4.445; 20 -1.905,4.445; 21 -3.175,4.445; 22 -4.445,4.445; 23 -5.715,4.445; 24 -6.985,4.445
SOTFL50P160X60-6N = smd 0.475 x 0.3: 1 -0.838,0.5; 2 -0.838,0; 3 -0.838,-0.5; 4 0.838,-0.5; 5 0.838,0; 6 0.838,0.5
PAP0064M_N = smd 1.45 x 0.3: 1 -5.725,3.75; 2 -5.725,3.25; 3 -5.725,2.75; 4 -5.725,2.25; 5 -5.725,1.75; 6 -5.725,1.25; 7 -5.725,0.75; 8 -5.725,0.25; 9 -5.725,-0.25; 10 -5.725,-0.75; 11 -5.725,-1.25; 12 -5.725,-1.75; 13 -5.725,-2.25; 14 -5.725,-2.75; 15 -5.725,-3.25; 16 -5.725,-3.75; 33 5.725,-3.75; 34 5.725,-3.25; 35 5.725,-2.75; 36 5.725,-2.25; 37 5.725,-1.75; 38 5.725,-1.25; 39 5.725,-0.75; 40 5.725,-0.25; 41 5.725,0.25; 42 5.725,0.75; 43 5.725,1.25; 44 5.725,1.75; 45 5.725,2.25; 46 5.725,2.75; 47 5.725,3.25; 48 5.725,3.75 | smd 0.3 x 1.45: 17 -3.75,-5.725; 18 -3.25,-5.725; 19 -2.75,-5.725; 20 -2.25,-5.725; 21 -1.75,-5.725; 22 -1.25,-5.725; 23 -0.75,-5.725; 24 -0.25,-5.725; 25 0.25,-5.725; 26 0.75,-5.725; 27 1.25,-5.725; 28 1.75,-5.725; 29 2.25,-5.725; 30 2.75,-5.725; 31 3.25,-5.725; 32 3.75,-5.725; 49 3.75,5.725; 50 3.25,5.725; 51 2.75,5.725; 52 2.25,5.725; 53 1.75,5.725; 54 1.25,5.725; 55 0.75,5.725; 56 0.25,5.725; 57 -0.25,5.725; 58 -0.75,5.725; 59 -1.25,5.725; 60 -1.75,5.725; 61 -2.25,5.725; 62 -2.75,5.725; 63 -3.25,5.725; 64 -3.75,5.725 | smd 4.6 x 4.6: 65 0,0
ASE = smd 1.1 x 0.9: 1 -1.25,-0.925; 2 1.25,-0.925; 3 1.25,0.925; 4 -1.25,0.925

### Placement (x,y rotation side)
C1  10,25.8 180 top
C2  24,25.8 0 top
C3  4.8,25.6 0 top
C4  10,24.7 180 top
C5  24,24.7 0 top
C6  10,22.45 180 top
C7  6.7,21.1 180 top
C8  10,21.15 180 top
C9  4.8,19.6 0 top
C10  29.6,19 0 top
C11  10,14.8 180 top
C12  29.6,17 0 top
C13  6.7,15.1 180 top
C14  29.6,15 0 top
C15  10,13.55 180 top
C16  4.9,13.6 0 top
C17  29.6,13 0 top
C18  6.7,9.1 180 top
C19  7.5,3 270 top
C20  19.8,15.4 270 bottom
C21  18.7,15.4 270 bottom
C22  17.5,15.4 270 bottom
C23  16.4,15.4 270 bottom
C24  12.3,15.5 270 bottom
C25  11.2,15.5 270 bottom
C26  10.1,15.5 270 bottom
C27  27.4,15.9 180 bottom
C28  10.7,18.3 90 bottom
C29  27,20.2 180 bottom
C30  7.5,20.8 180 bottom
C31  27,21.3 180 bottom
C32  7.5,22 0 bottom
C33  27,22.4 180 bottom
C34  27,23.5 180 bottom
C35  27,24.8 180 bottom
C36  7.5,26.2 0 bottom
C37  7.5,27.3 0 bottom
C38  7.5,28.4 0 bottom
C39  18.4,32.7 180 bottom
C40  16,32.7 0 bottom
D1  4,6.5 180 top
IN  1.5,17 270 bottom
J1  17,30 180 top
J2  17,3 0 bottom
L1  7,23.3 90 top
L2  7,17.3 90 top
L3  7,11.3 90 top
LED1  27.5,3 0 bottom
LED2  32,27 90 bottom
OUT  32.5,17 270 bottom
Q1  32,25 180 top
Q2  31,7 90 top
Q3  31,7 270 bottom
Q4  3.8,7 90 bottom
R1  32,28 0 top
R2  4.2,22.3 180 top
R3  4.2,21.1 180 top
R4  26.6,19 0 top
R5  26.6,17 0 top
R6  4.2,16.3 180 top
R7  4.2,15.1 180 top
R8  26.6,15 0 top
R9  26.6,13 0 top
R10  4.2,10.3 180 top
R11  31,9.5 0 top
R12  4.2,9.1 180 top
R13  27.5,7 90 top
R14  6,3 270 top
R15  27.5,7 90 bottom
R16  6.5,7 270 bottom
R17  1,7 270 bottom
R18  31,9.5 180 bottom
R19  11k 1%  [R0402']  13.5,15.5 90 bottom
R20  32,25.5 0 bottom
R21  2k2  [R0402']  25.3,32 270 bottom
R22  2k49  [R0402']  24.2,32 90 bottom
R23  6k04  [R0402']  23.1,32 270 bottom
R24  6k04  [R0402']  22,32 270 bottom
R25  6k04  [R0402']  20.9,32 90 bottom
R26  2k2  [R0402']  12.5,32.7 180 bottom
T1  17,18 270 top
U1  4.5,24 180 top
U2  4.5,18 180 top
U3  4.5,12 180 top
U4  17,24 90 bottom
X3  8,18.7 0 bottom

### Tracks (layer width: path | path; a pad name or v marks a point on that pad's centre or on a via)
1.1V  (via drill 0.3)
  Top 0.4: 7.35,16.3 7.5,16.45 v7.5,16.9 v7,16.9 | v7,16.9 L2.1 | v7,16.9 v6.5,16.9 6.5,16.3
  Top 0.6: L2.1 6.5,16.3 R6.1
  Top 0.8: L2.1 7.35,16.3 7.55,16.1 C13.1
  Route15 0.3: v18,28.6 18,27.8
  Route15 0.6: 17.7,23.2 17.5,23 17.5,21.2 17.3,21 | 17.7,23.2 v20.3,23.2 | v12.6,26.2 13.8,25 17.4,25 | 17.4,25 17.5,24.9 17.5,23.4 17.7,23.2 | 17.4,25 18,25.6 18,27.8 | v6.5,16.9 v7,16.9 v7.5,16.9 9.9,16.9 14,21 17.3,21 | v17.5,19.7 17.5,20.8 17.3,21
  Bottom 0.3: v17.5,19.7 17.25,19.45 U4.8 17.25,16.3 C22.1 | v20.3,23.2 20.35,23.25 U4.58 26.1,23.25 C34.1 | U4.42 17.75,28.85 v18,28.6 | v12.6,26.2 12.55,26.25 U4.29 8.2,26.25 C36.1
  Bottom 0.6: C34.1 C33.1 C31.1 C29.1 | C23.1 C22.1 | C36.1 C37.1 C38.1
2.5V  (via drill 0.3)
  Top 0.4: 7.35,10.3 7.5,10.45 v7.5,10.9 v7,10.9 | v7,10.9 L3.1 | 6.5,10.3 v6.5,10.9 v7,10.9
  Top 0.6: L3.1 6.5,10.3 R10.1
  Top 0.8: L3.1 7.35,10.3 7.55,10.1 C18.1
  Route15 0.4: v15.3,19.7 15.3,19.2 | 15.3,19.2 15.5,19 19.3,19 v19.3,19.8 | v6.5,10.9 v7,10.9 v7.5,10.9 7.49,10.91 7.49,11.39 15.3,19.2
  Bottom 0.3: U4.12 15.25,19.65 v15.3,19.7 12.7,19.7 12.3,19.3 C24.1 | v19.3,19.8 19.25,19.75 U4.4 19.25,16.1 19.3,16.05
  Bottom 0.6: C21.1 19.3,16.05 C20.1 | C26.1 C25.1 C24.1
3.3V  (via drill 0.3)
  Top 0.4: 7.35,22.3 7.5,22.45 v7.5,22.9 v7,22.9 | v7,22.9 L1.1 | C1.1 C4.1 11,24.35 v12.45,24.35 | C2.1 C5.1 23.35,24.15 v23.75,23.75 | v7,22.9 v6.5,22.9 6.5,22.3
  Top 0.6: L1.1 6.5,22.3 R2.1
  Top 0.8: L1.1 7.35,22.3 7.55,22.1 C7.1
  Route15 0.15: 11.7,29.5 11.8,29.6 v11.8,31.4
  Route15 0.2: J2.10 13.6,10 22.69,10 | 22.69,10 J2.12 26.97,8.83 27.5,8.3 v27.5,1.2 | 22.69,10 23.3,10.61 23.3,23.3 v23.75,23.75
  Route15 0.4: 10.6,26 10.6,28.8 11.3,29.5 11.7,29.5 15.8,29.5 v17.2,30.9 18.6,29.5 26,29.5 | v26.5,33.6 26.5,33 26,32.5 26,29.5 | 26,28.2 27.2,27 v29.5,27 | 26,28.2 26,29.5 | 26,28.2 23.75,25.95 v23.75,23.75
  Route15 0.6: v7.5,22.9 v7,22.9 v6.5,22.9 | v12.45,24.35 12.25,24.35 10.6,26 v7.5,22.9 | v7.5,22.9 7.5,20.4 v8.3,19.6
  Bottom 0.15: R21.1 25.3,32.1 25.2,32 23.2,32 23.1,32.1 R23.1
  Bottom 0.3: U4.41 17.25,30.85 v17.2,30.9 | U4.23 12.25,23.25 12.45,23.45 v12.45,24.35 | C35.1 24.8,24.8 v23.75,23.75 U4.57
  Bottom 0.4: R24.1 R23.1 | R21.1 26.35,32.65 26.5,32.8 v26.5,33.6 | LED1.A v27.5,1.2 | v17.2,30.9 17.2,32.7 | 17.2,32.7 C40.1 | 17.2,32.7 C39.1 | C28.1 9.38,17.65 X3.1 X3.4 8.32,19.62 v8.3,19.6 | R26.1 11.85,31.45 v11.8,31.4 | LED2.A v29.5,27
+5V
  Top 0.3: 8.5,27 J1.70 J1.69 | J1.67 J1.68 9,27 9.5,27 J1.66 J1.65 | U1.3 U1.4 3.66,25.4 3.86,25.6 C3.1 | U2.3 U2.4 3.66,19.4 3.86,19.6 C9.1 | U3.3 U3.4 3.66,13.4 3.86,13.6 C16.1
  Top 0.8: 9,27 8.5,27 3.2,27 2.8,26.6 2.8,25.6 | C16.1 2.8,13.6 2.8,14 | 2.8,25.6 C3.1 | 2.8,14 2.8,16.1 | 2.8,16.1 2.8,17.9 | 2.8,17.9 2.8,19.7 | 2.8,19.7 2.8,20 | 2.8,20 2.8,25.6 | C9.1 2.9,19.6 2.8,19.7 | IN.5 2.8,14 | IN.4 2.7,16 2.8,16.1 | IN.3 2.7,18 2.8,17.9 | IN.2 2.8,20
ETH_1  (via drill 0.3)
  Top 0.4: T1.24 20.73,24.98 v20.4,24.65
  Route2 0.15: J2.1 13.44,7.04 16.7,10.3 16.7,23.9 16.8,24 17,24 17.1,23.9 17.1,23.2 17.2,23.1 17.3,23.1 18.7,24.5 20.25,24.5 v20.4,24.65
ETH_2  (via drill 0.3)
  Top 0.4: T1.23 20.73,23.71 v20.4,24.05
  Route2 0.15: J2.2 14.46,7.56 17,10.1 17,22.35 18.85,24.2 20.25,24.2 v20.4,24.05
ETH_3  (via drill 0.3)
  Top 0.4: T1.20 22.09,19.91 v22.45,19.55
  Route2 0.15: J2.3 15.48,7.78 17.4,9.7 17.4,17.4 19.4,19.4 20,19.4 20.1,19.5 20.1,20.9 20.2,21 20.3,21 20.4,20.9 20.4,19.5 20.5,19.4 22.3,19.4 v22.45,19.55
ETH_4  (via drill 0.3)
  Top 0.4: T1.18 22.09,17.36 v22.45,17
  Route2 0.15: J2.4 16.49,6.79 18.6,8.9 18.6,14.7 18.95,15.05 22.5,15.05 22.6,15.15 22.6,15.4 22.5,15.5 20.8,15.5 20.6,15.7 20.6,16.6 20.85,16.85 22.3,16.85 v22.45,17
ETH_5  (via drill 0.3)
  Top 0.4: T1.17 22.14,16.09 v22.45,16.4
  Route2 0.15: J2.5 17.51,7.43 18.91,8.83 18.91,14.61 19.1,14.8 22.5,14.8 22.6,14.7 22.6,13.1 22.7,13 22.8,13 22.9,13.1 22.9,15.6 22.7,15.8 21,15.8 20.9,15.9 20.9,16.4 21.05,16.55 22.3,16.55 v22.45,16.4
ETH_6  (via drill 0.3, 0.35)
  Top 0.4: T1.19 22.13,18.64 v22.45,18.95
  Route2 0.15: v16.1,7.6 16.1,7.9 17.7,9.5 17.7,17.3 19.5,19.1 22.3,19.1 v22.45,18.95
  Bottom 0.15: J2.6 18.32,3.89 16.45,5.76 16.45,7.25 v16.1,7.6
ETH_7  (via drill 0.3)
  Top 0.4: T1.14 22.12,12.29 v22.45,11.95
  Route2 0.15: J2.7 19.54,9.94 19.85,10.25 25.85,10.25 25.9,10.3 25.9,10.6 25.85,10.65 20.15,10.65 20,10.8 20,11.7 20.1,11.8 22.3,11.8 v22.45,11.95
ETH_8  (via drill 0.3)
  Top 0.4: T1.13 22.12,11.02 v22.45,11.35
  Route2 0.15: J2.8 20.56,6.89 19.8,7.65 19.8,9.8 20,10 26,10 26.2,10.2 26.2,10.7 26,10.9 21.7,10.9 21.6,11 21.6,11.4 21.7,11.5 22.3,11.5 v22.45,11.35
FPGA_LED  (via drill 0.35)
  Top 0.25: J1.57 11.5,31.9 v11.2,31.6
  Top 0.4: R1.1 v29.5,28
  Route2 0.15: v29.5,28 26.4,28 24.4,30 11.5,30 11.2,30.3 v11.2,31.6
GND  (via drill 0.3)
  Top 0.6: C7.2 R3.1 | C13.2 R7.1 | C18.2 R12.1
  other vias: 27.3,30.8 28.2,29.2 6.7,29.2 5.8,30.8 25.5,33.6 24,33.6 22.5,33.6 21,33.6 19.5,33.6 18,33.6 16.5,33.6 15,33.6 13.5,33.6 12,33.6 11,33.6 12,28.4 21,26.5 25.5,26.5 24,17 24,15 24,13 19.1,26.1 14.9,26.1 8.5,25 6.7,13.6 6,1 7.5,1 16,13.9 19.8,13.9 28.5,21.3 28.5,22.4 28.5,23.5 28.5,24.8 9.5,23.5 16.2,19.7 22.5,28.8 18.15,13.9 19.1,21.9 16,24 9,16 31,7 3.8,7
  pour Route2: 0,0 34,0 34,34 0,34
  pour Top (rank 2): 0,0 34,0 34,34 0,34
  pour Bottom: 0,0 34,0 34,34 0,34
  pour Route15 (rank 2): 0,0 34,0 34,34 0,34
LED0
  Top 0.4: R13.1 26.55,5.2 23.3,5.2 21.57,6.93 J2.11
LED1
  Bottom 0.4: R16.1 6.5,8.3 7.03,8.83 J2.9
N$00001  (via drill 2.6 pad 4.5)
  other vias: 31.5,31.5
N$00002  (via drill 2.6 pad 4.5)
  other vias: 2.5,31.5
N$00007  (via drill 2.6 pad 4.5)
  other vias: 2.5,2.5
N$00008  (via drill 2.6 pad 4.5)
  other vias: 31.5,2.5
N$00013
  Bottom 0.4: C30.1 6.85,19.73 X3.3
N$00014
  Bottom 0.4: R15.2 28.15,7.85 29,7 Q3.3
N$00015
  Bottom 0.4: Q3.1 31.85,8.3 R18.2
N$00022
  Top 0.4: T1.10 C15.1
N$00023
  Top 0.4: T1.9 12.53,14.8 C11.1
N$00024
  Top 0.4: T1.4 10.68,21.18 C8.1
N$00025
  Top 0.4: T1.3 C6.1
N$00026
  Bottom 0.15: 8.15,21.2 8.2,21.25 U4.19
  Bottom 0.4: C30.2 8.15,21.2 C32.1
N$00027
  Top 0.3: U2.2 6.8,18 7,18.2 L2.2
N$00028
  Top 0.3: U1.2 6.8,24 7,24.2 L1.2
N$00029
  Top 0.3: U3.2 6.8,12 7,12.2 L3.2
N$00030
  Top 0.3: U3.5 4.2,12 4.3,11.9 4.3,11.1 3.7,10.5 R10.2
  Top 0.6: R10.2 R12.2
N$00031  (via drill 0.35)
  Top 0.4: Q1.3 31.2,23.8 v31,24
  Bottom 0.4: R20.2 31,25.35 v31,24
N$00032
  Bottom 0.4: LED1.C R15.1
N$00034
  Top 0.4: R1.2 32.85,26.3 Q1.1
N$00035
  Bottom 0.4: LED2.C 32.85,26.8 R20.1
N$00040
  Top 0.3: U2.5 4.1,18 4.3,17.8 4.3,17.1 3.7,16.5 R6.2
  Top 0.6: R6.2 R7.2
N$00044
  Top 0.3: U1.5 4.1,24 4.3,23.8 4.3,23.1 3.7,22.5 R2.2
  Top 0.6: R2.2 R3.2
N$00049
  Top 0.8: C14.1 R8.2
N$00050
  Top 0.8: C17.1 R9.2
N$00051
  Top 0.8: C10.1 R4.2
N$00052
  Top 0.8: C12.1 R5.2
N$00053  (via drill 0.3)
  Top 0.4: R9.1 v25,13 | R8.1 v25,15 | R5.1 v25,17 | R4.1 v25,19
  Bottom 0.4: v25,13 v25,15 v25,17 | v25,17 v25,19 | C27.1 25,15.9 v25,17
N$00084
  Bottom 0.3: U4.15 13.75,16.9 13.5,16.65 R19.2
N$00105
  Bottom 0.4: Q4.3 5.85,6.15 R16.2
N$00107
  Top 0.4: Q2.3 29,7 28.15,7.85 R13.2
N$00108
  Bottom 0.4: R17.2 1.1,6.05 Q4.1
N$00109
  Top 0.4: Q2.1 33.05,6.05 33.3,6.3 33.3,9.3 33.1,9.5 R11.2
PE  (1 unrouted)
  Top 0.8: R14.1 7.4,3.85 C19.1 8.5,4.95 8.5,6.87 J2.S2 8.13,6.5 D1.C
PHY2_MDI0_N  (via drill 0.3)
  Top 0.15: v19.8,17 19.8,18.3 13.88,24.21 13.41,24.21 12.91,23.71 T1.2
  Bottom 0.3: U4.3 19.75,17.05 v19.8,17
PHY2_MDI0_P  (via drill 0.3)
  Top 0.15: v20.3,17.2 20.1,17.4 20.1,18.4 14,24.5 13.4,24.5 12.91,24.98 T1.1
  Bottom 0.3: U4.2 20.25,17.25 v20.3,17.2
PHY2_MDI1_N  (via drill 0.3)
  Top 0.15: v18.2,17.2 18.4,17.4 18.4,17.7 16.7,19.4 16.7,20.2 15.3,21.6 14.9,21.6 14.7,21.4 14.7,19.8 14.03,19.12 13.43,19.12 13.1,18.8 13.1,18.7 13.04,18.64 T1.6
  Bottom 0.3: U4.6 18.25,17.25 v18.2,17.2
PHY2_MDI1_P  (via drill 0.3)
  Top 0.15: v18.7,17 18.7,17.8 17,19.5 17,20.3 15.4,21.9 14.8,21.9 14.4,21.5 14.4,19.9 13.9,19.4 13.4,19.4 12.89,19.91 T1.5
  Bottom 0.3: U4.5 18.75,17.05 v18.7,17
PHY2_MDI2_N  (via drill 0.3)
  Top 0.15: T1.8 12.89,16.09 13.4,16.6 14.7,16.6 15,16.9 15,18.8 15.1,18.9 16.2,18.9 17.2,17.9 17.2,17.4 17.1,17.3 16.2,17.3 v15.7,16.8
  Bottom 0.3: U4.11 15.75,16.85 v15.7,16.8
PHY2_MDI2_P  (via drill 0.3)
  Top 0.15: T1.7 12.93,17.36 13.4,16.9 14.6,16.9 14.7,17 14.7,18.9 15,19.2 16.3,19.2 17.5,18 17.5,17.3 17.2,17 16.5,17 v16.3,16.8
  Bottom 0.3: U4.10 16.25,16.85 v16.3,16.8
PHY2_MDI3_N  (via drill 0.3)
  Top 0.15: v15,15 15.15,15.15 15.15,15.3 15.05,15.4 14.7,15.4 14.5,15.2 14.5,13.4 15.6,12.3 15.6,11.8 15.3,11.5 13.4,11.5 12.91,11.02 T1.12
  Bottom 0.15: U4.14 14.25,16.35 15.1,15.5 15.1,15.1 v15,15
PHY2_MDI3_P  (via drill 0.3)
  Top 0.15: v15.6,15 15.45,15.15 15.45,15.4 15.15,15.7 14.6,15.7 14.2,15.3 14.2,13.3 15.3,12.2 15.3,11.9 15.2,11.8 13.4,11.8 13.1,12.1 13.1,12.2 13.02,12.29 T1.11
  Bottom 0.15: U4.13 14.75,16.35 15.5,15.6 15.5,15.1 v15.6,15
PHY_!INT!_!PWDN  (via drill 0.3)
  Top 0.15: v24.5,22.25 26.55,22.25 27,22.7 27,27.8 25.1,29.7 v25.1,30.7
  Top 0.25: J1.3 25,30.8 v25.1,30.7
  Bottom 0.3: v24.5,22.25 U4.60
  Bottom 0.4: v25.1,30.7 25.1,31.15 R21.2
PHY_LED0  (via drill 0.3)
  Top 0.4: R11.1 29.2,9.5 29,9.3 v29,9
  Route15 0.2: v25,20.8 28.5,17.3 28.5,9.5 v29,9
  Bottom 0.3: U4.63 24.95,20.75 v25,20.8
PHY_LED1  (via drill 0.3)
  Route15 0.2: v1,8.7 1,8.5 8.9,0.6 27.8,0.6 28,0.8 28,17 24.5,20.5 v24.5,21.25
  Bottom 0.3: U4.62 v24.5,21.25
  Bottom 0.4: R17.1 v1,8.7
PHY_LED2  (via drill 0.3)
  Route15 0.2: v25,21.7 29,17.7 v29,10
  Bottom 0.3: U4.61 24.95,21.75 v25,21.7
  Bottom 0.4: R18.1 29.2,9.5 29,9.7 v29,10
PHY_MDC  (via drill 0.3)
  Top 0.25: J1.53 v12.5,31.7
  Bottom 0.15: U4.20 9.95,21.75 7.7,24 5.1,24 4.7,24.4 4.7,28.7 6.1,30.1 12.1,30.1 12.5,30.5 v12.5,31.7
PHY_MDIO  (via drill 0.3)
  Top 0.25: J1.51 v13,31.5
  Bottom 0.15: v13,31.5 12.8,31.3 12.8,30.4 12.2,29.8 6.2,29.8 5,28.6 5,24.5 5.2,24.3 7.8,24.3 9.85,22.25 U4.21
  Bottom 0.4: R26.2 13.15,31.65 v13,31.5
PHY_RST  (via drill 0.3)
  Top 0.15: J1.5 24.5,29.9 26.7,27.7 26.7,23 26.45,22.75 v25,22.75
  Bottom 0.3: U4.59 v25,22.75
PHY_RX0  (via drill 0.3)
  Top 0.25: J1.30 v18.5,28.3
  Bottom 0.15: U4.44 18.75,28.95 18.5,28.7 v18.5,28.3
PHY_RX1  (via drill 0.3)
  Top 0.25: J1.29 v18.5,31.5
  Bottom 0.15: U4.45 19.25,30.55 18.5,31.3 v18.5,31.5
PHY_RX2  (via drill 0.3)
  Top 0.25: v19.1,28.3 19,28.2 J1.28
  Bottom 0.15: U4.46 19.75,28.95 v19.1,28.3
PHY_RX3  (via drill 0.3)
  Top 0.25: J1.27 v19,31.7
  Bottom 0.15: U4.47 20.25,30.45 v19,31.7
PHY_RX4  (via drill 0.3)
  Top 0.25: J1.24 v20,28.3
  Bottom 0.15: v20,28.3 20,28.6 20.1,28.7 20.5,28.7 20.75,28.95 U4.48
PHY_RX5  (via drill 0.3)
  Top 0.25: J1.16 v22,28.3
  Bottom 0.15: U4.49 22.25,27.75 22,28 v22,28.3
PHY_RX6  (via drill 0.3)
  Top 0.25: v21.4,28.3 21.5,28.2 J1.18
  Bottom 0.15: U4.50 21.65,27.25 21.4,27.5 v21.4,28.3 21.4,29.5 22,30.1 22,31.3 R24.2
  Bottom 0.4: R25.1 21.95,31.35 22,31.3
PHY_RX7  (via drill 0.3)
  Top 0.25: v20.6,28.3 20.5,28.2 J1.22
  Bottom 0.15: U4.51 21.45,26.75 20.6,27.6 v20.6,28.3
PHY_RX_ER  (via drill 0.3)
  Top 0.25: J1.6 v24.5,28.3
  Bottom 0.15: U4.54 24.05,25.25 24.5,25.7 v24.5,28.3
PHY_RXCK  (via drill 0.3)
  Top 0.25: J1.33 17.5,31.8 v17.8,31.5
  Bottom 0.15: U4.43 18.25,30.55 17.8,31 v17.8,31.5
PHY_RXCTL_DV  (via drill 0.3)
  Top 0.25: J1.10 v23.5,28.8
  Bottom 0.15: U4.53 23.85,25.75 24.2,26.1 24.2,28 23.5,28.7 v23.5,28.8 23.5,30.95 R23.2
  Bottom 0.4: R22.1 R23.2
PHY_TX0  (via drill 0.3)
  Top 0.25: v16.9,28.3 17,28.2 J1.36
  Bottom 0.15: U4.38 15.75,29.05 16.1,28.7 16.5,28.7 v16.9,28.3
PHY_TX1  (via drill 0.3)
  Top 0.25: J1.39 v16,31.5
  Bottom 0.15: U4.37 15.25,30.55 16,31.3 v16,31.5
PHY_TX2  (via drill 0.3)
  Top 0.25: v16.1,28.3 16,28.2 J1.40
  Bottom 0.15: U4.36 14.75,29.05 15,28.8 15.6,28.8 v16.1,28.3
PHY_TX3  (via drill 0.3)
  Top 0.25: J1.41 v15.5,31.7
  Bottom 0.15: U4.35 14.25,30.45 v15.5,31.7
PHY_TX4  (via drill 0.3)
  Top 0.25: J1.42 v15.5,28.3
  Bottom 0.15: U4.34 13.75,28.95 14,28.7 14.7,28.7 15.1,28.3 v15.5,28.3
PHY_TX5  (via drill 0.3)
  Top 0.25: J1.45 v14.5,31.7
  Bottom 0.15: U4.33 13.25,30.95 13.4,31.1 13.9,31.1 v14.5,31.7
PHY_TX6  (via drill 0.3)
  Top 0.25: v13.9,28.3 14,28.2 J1.48
  Bottom 0.15: U4.32 13.65,27.75 13.9,28 v13.9,28.3
PHY_TX7  (via drill 0.3)
  Top 0.25: J1.46 v14.5,28.3
  Bottom 0.15: U4.31 13.85,27.25 14.5,27.9 v14.5,28.3
PHY_TX_ER  (via drill 0.3)
  Top 0.25: J1.35 17,31.8 16.7,31.5 v16.6,31.5
  Bottom 0.15: U4.39 16.25,30.65 16.6,31 v16.6,31.5
PHY_TXCK  (via drill 0.3)
  Top 0.25: J1.34 v17.5,28.3
  Bottom 0.15: U4.40 16.75,28.95 17,28.7 17.2,28.7 17.5,28.4 v17.5,28.3
PHY_TXCK_10/100  (via drill 0.3)
  Top 0.25: J1.52 13,26.7 13.3,26.4 v13.5,26.4
  Bottom 0.152: U4.30 13.15,26.75 v13.5,26.4
PHY_TXCTL_DV  (via drill 0.3)
  Top 0.25: J1.12 v23,28.3
  Bottom 0.15: U4.52 23.65,26.25 23.8,26.4 23.8,27.9 23.4,28.3 v23,28.3
POE+_MODE_A
  Top 0.4: 30.5,20 OUT.2 | C10.2 30.45,19.95 30.5,20 | T1.22 22.36,22.45 24.8,20 30.5,20
POE+_MODE_B
  Top 0.4: 30.5,16 23.9,16 22.73,14.82 T1.16 | 30.5,16 OUT.4 | C14.2 30.45,15.95 30.5,16
POE-_MODE_A
  Top 0.4: 30.4,18 OUT.3 | C12.2 30.45,17.95 30.4,18 | T1.21 22.12,21.18 24,19.29 24,18.3 24.3,18 30.4,18
POE-_MODE_B
  Top 0.4: 30.4,14 OUT.5 | C17.2 30.45,13.95 30.4,14 | T1.15 23.36,13.55 23.8,14 30.4,14